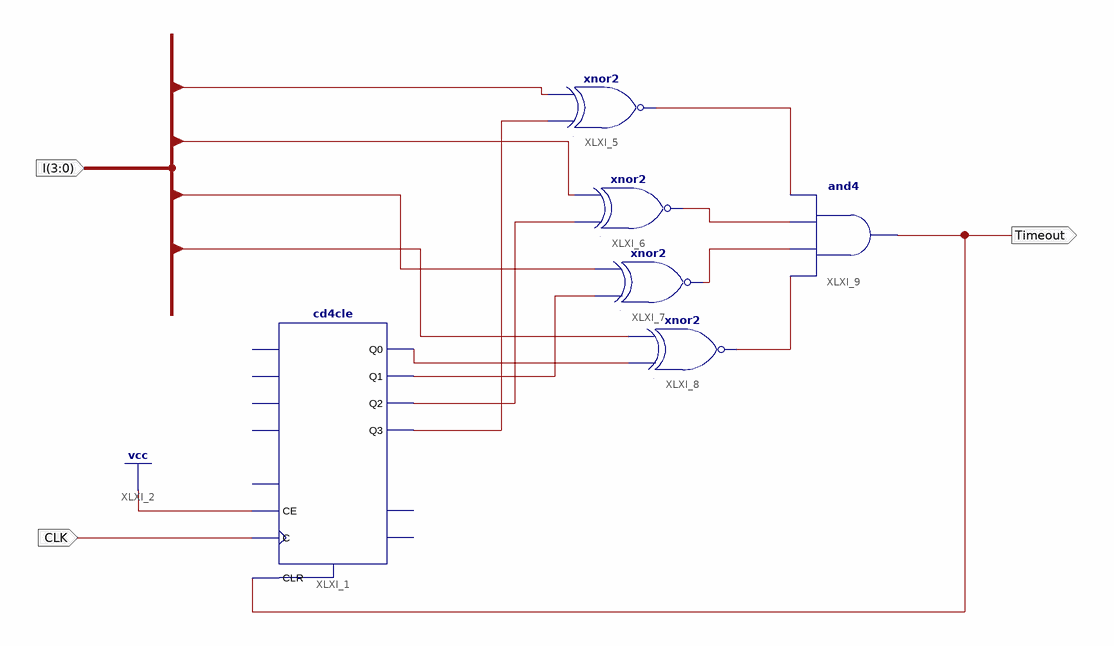
[diagram p0: schematic sheet 1]
// Xilinx ISE schematic Timer.sch (spartan6) as structural Verilog: 6 symbols, 3 ports
module Timer (
  input  CLK,
  input  [3:0] I,
  output Timeout
);

  wire XLXN_15, XLXN_26, XLXN_27, XLXN_31, XLXN_32, XLXN_33, XLXN_34, XLXN_35;

  cd4cle XLXI_1 (
    .C(CLK), .CE(1'b1), .CLR(Timeout), .Q0(XLXN_31), .Q1(XLXN_27), .Q2(XLXN_26), .Q3(XLXN_15));  // open: D0, D1, D2, D3, L, CEO, TC
  xnor XLXI_5 (XLXN_32, XLXN_15, I[3]);
  xnor XLXI_6 (XLXN_33, XLXN_26, I[2]);
  xnor XLXI_7 (XLXN_34, XLXN_27, I[1]);
  xnor XLXI_8 (XLXN_35, XLXN_31, I[0]);
  and XLXI_9 (Timeout, XLXN_35, XLXN_34, XLXN_33, XLXN_32);
endmodule
